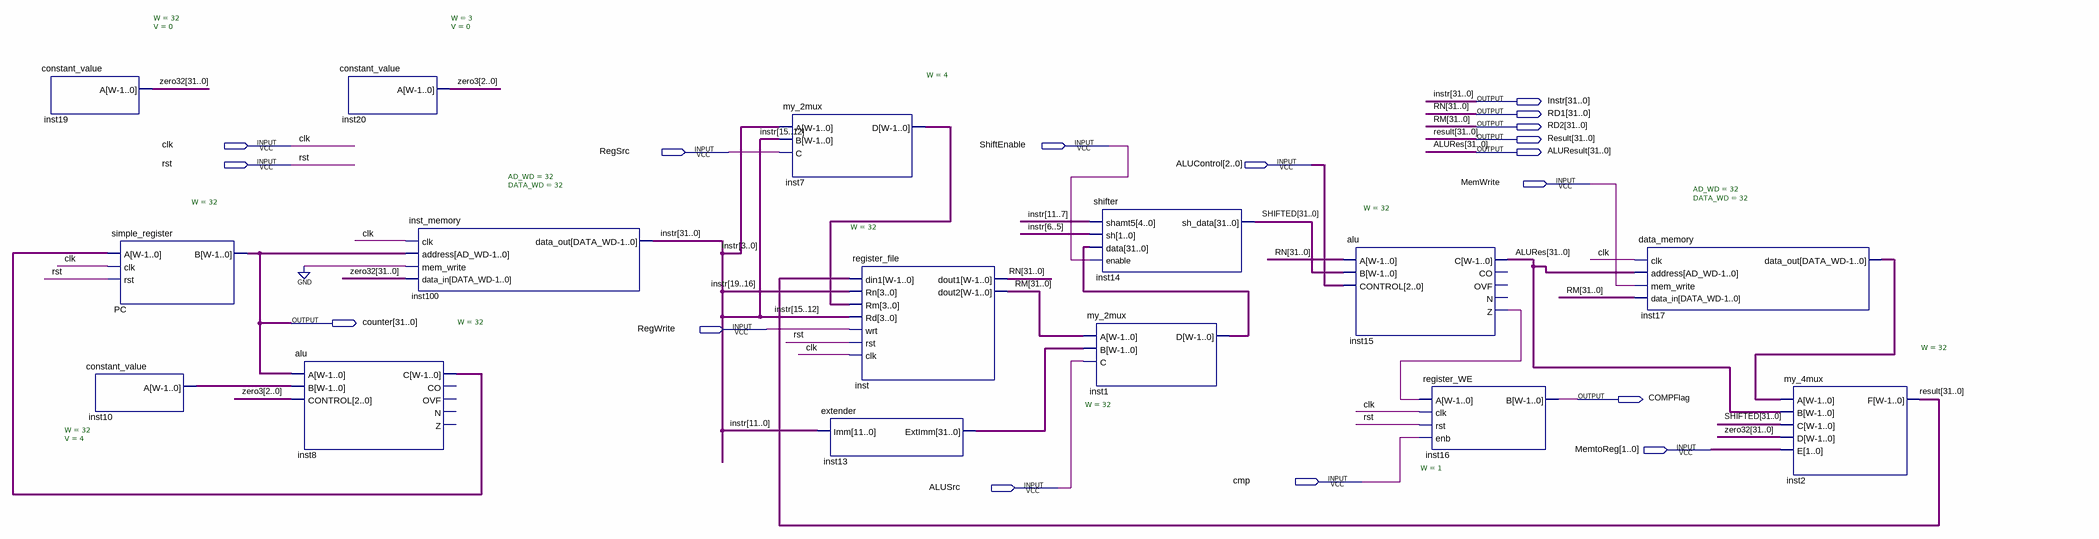
[diagram p0: schematic sheet]
// Quartus schematic datapath.bdf as structural Verilog: 15 symbols, 17 pins
module datapath (
  input  clk,
  input  ShiftEnable,
  input  RegSrc,
  input  rst,
  input  [2:0] ALUControl,
  input  MemWrite,
  input  RegWrite,
  input  [1:0] MemtoReg,
  input  cmp,
  input  ALUSrc,
  output [31:0] Instr,
  output [31:0] RD1,
  output [31:0] RD2,
  output [31:0] Result,
  output [31:0] ALUResult,
  output [31:0] counter,
  output COMPFlag
);

  wire inst15_z;
  wire [2:0] zero3;
  wire [3:0] inst7_d;
  wire [31:0] inst1_d, inst8_c, inst10_a, inst13_extimm, inst17_data_out, SHIFTED, zero32;

  constant_value #(.W(32), .V(0)) inst19 (.A(zero32));
  constant_value #(.W(32), .V(4)) inst10 (.A(inst10_a));
  simple_register #(.W(32)) PC (.A(inst8_c), .clk(clk), .rst(rst), .B(counter));
  alu #(.W(32)) inst8 (.A(counter), .B(inst10_a), .CONTROL(zero3), .C(inst8_c));  // open: CO, OVF, N, Z
  constant_value #(.W(3), .V(0)) inst20 (.A(zero3));
  inst_memory #(.AD_WD(32), .DATA_WD(32)) inst100 (
    .clk(clk), .address(counter), .mem_write(1'b0), .data_in(zero32), .data_out(Instr));
  my_2mux #(.W(4)) inst7 (.A(Instr[3:0]), .B(Instr[15:12]), .C(RegSrc), .D(inst7_d));
  register_file #(.W(32)) inst (
    .din1(Result), .Rn(Instr[19:16]), .Rm(inst7_d), .Rd(Instr[15:12]), .wrt(RegWrite), .rst(rst), .clk(clk),
    .dout1(RD1), .dout2(RD2));
  extender inst13 (.Imm(Instr[11:0]), .ExtImm(inst13_extimm));
  shifter inst14 (.shamt5(Instr[11:7]), .sh(Instr[6:5]), .data(inst1_d), .enable(ShiftEnable), .sh_data(SHIFTED));
  my_2mux #(.W(32)) inst1 (.A(RD2), .B(inst13_extimm), .C(ALUSrc), .D(inst1_d));
  alu #(.W(32)) inst15 (.A(RD1), .B(SHIFTED), .CONTROL(ALUControl), .C(ALUResult), .Z(inst15_z));  // open: CO, OVF, N
  register_WE #(.W(1)) inst16 (.A(inst15_z), .clk(clk), .rst(rst), .enb(cmp), .B(COMPFlag));
  data_memory #(.AD_WD(32), .DATA_WD(32)) inst17 (
    .clk(clk), .address(ALUResult), .mem_write(MemWrite), .data_in(RD2), .data_out(inst17_data_out));
  my_4mux #(.W(32)) inst2 (.A(inst17_data_out), .B(ALUResult), .C(SHIFTED), .D(zero32), .E(MemtoReg), .F(Result));

  // Other names for the same wires on the sheet: ALURes[31:0] = ALUResult; RM[31:0] = RD2; RN[31:0] = RD1
endmodule
